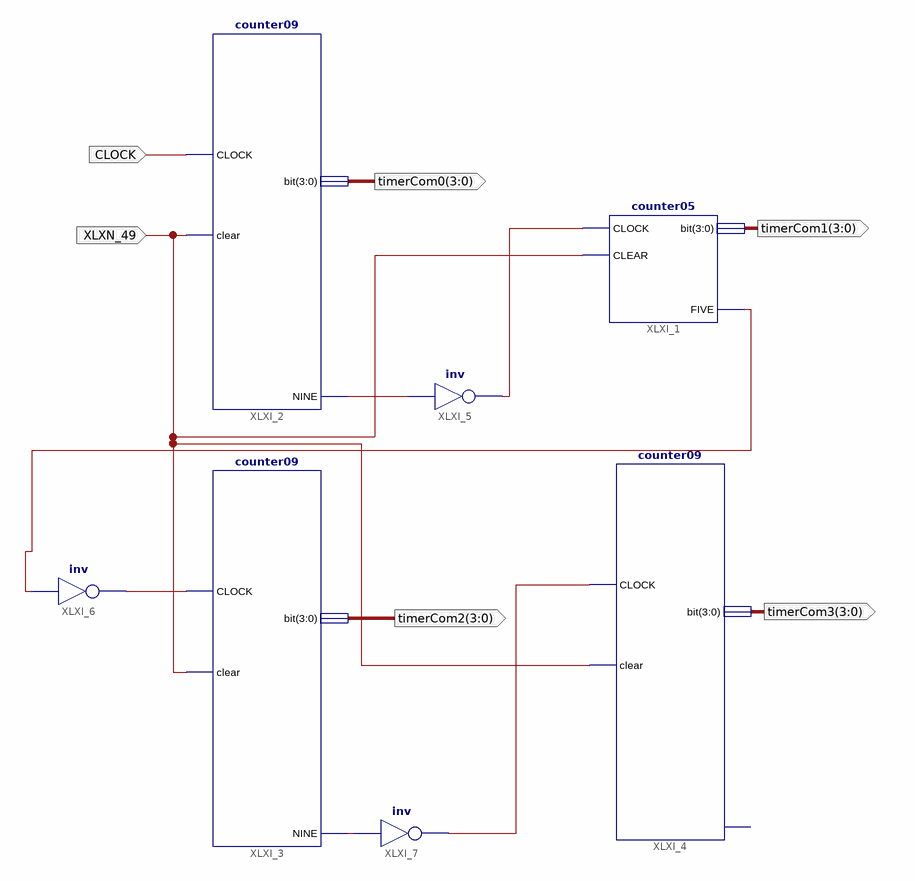
[diagram p0: schematic sheet 1]
// Xilinx ISE schematic time3210.sch (spartan6) as structural Verilog: 7 symbols, 6 ports
module time3210 (
  input  CLOCK,
  input  XLXN_49,
  output [3:0] timerCom0,
  output [3:0] timerCom2,
  output [3:0] timerCom3,
  output [3:0] timerCom1
);

  wire XLXN_29, XLXN_31, XLXN_33, XLXN_34, XLXN_35, XLXN_51;

  counter09 XLXI_3 (.CLOCK(XLXN_51), .clear(XLXN_49), .\bit (timerCom2), .NINE(XLXN_33));
  counter09 XLXI_4 (.CLOCK(XLXN_34), .clear(XLXN_49), .\bit (timerCom3));  // open: NINE
  counter09 XLXI_2 (.CLOCK(CLOCK), .clear(XLXN_49), .\bit (timerCom0), .NINE(XLXN_35));
  not XLXI_5 (XLXN_29, XLXN_35);
  not XLXI_6 (XLXN_51, XLXN_31);
  not XLXI_7 (XLXN_34, XLXN_33);
  counter05 XLXI_1 (.CLOCK(XLXN_29), .CLEAR(XLXN_49), .\bit (timerCom1), .FIVE(XLXN_31));
endmodule
